# Altium schematic sheet obc_flash.SchDoc: Flash Memory
size A4; DrawnBy: Mohamed Hirole; Organization: UTAT SS; DocumentNumber: 2; Revision: 2.0; SheetNumber: 2; SheetTotal: 8
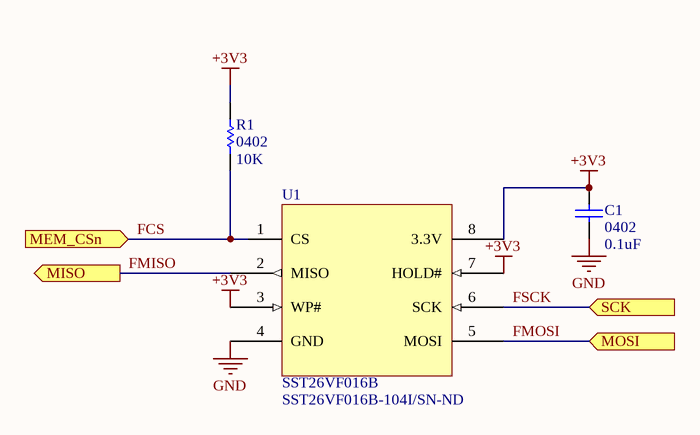
[diagram p0: obc_flash.SchDoc]

## Parts
C1  0402  value 0.1uF  [CAP0402R]
R1  0402  value 10K  [RES0402R]
U1  SST26VF016B  Supplier Part Number 1: SST26VF016B-104I/SN-ND  [SOIC127P500X600-8N]

## Ports
MEM_CSn (in), MISO (out), MOSI (in), SCK (in)

## Nets
+3V3: C1.1 R1.2 U1.3(WP#) U1.7(HOLD#) U1.8(3.3V)
GND: C1.2 U1.4(GND)
FCS: R1.1 U1.1(CS) ; port MEM_CSn
FMISO: U1.2(MISO) ; port MISO
FMOSI: U1.5(MOSI) ; port MOSI
FSCK: U1.6(SCK) ; port SCK

## Library data of the parts
C1 = CAP0402: 0402 capacitor
R1 = RES0402: 0402 resistor
U1 = SST26VF016B: 2.5V/3.0V 16 Mbit Serial Quad I/O (SQI) Flash Memory; ComponentLink1Description: SST25VF016B; ComponentLink1URL: https://www.digikey.ca/product-detail/en/microchip-technology/SST26VF016B-104I-SN/SST26VF016B-104I-SN-ND/5033651; Supplier 1: Digi-Key